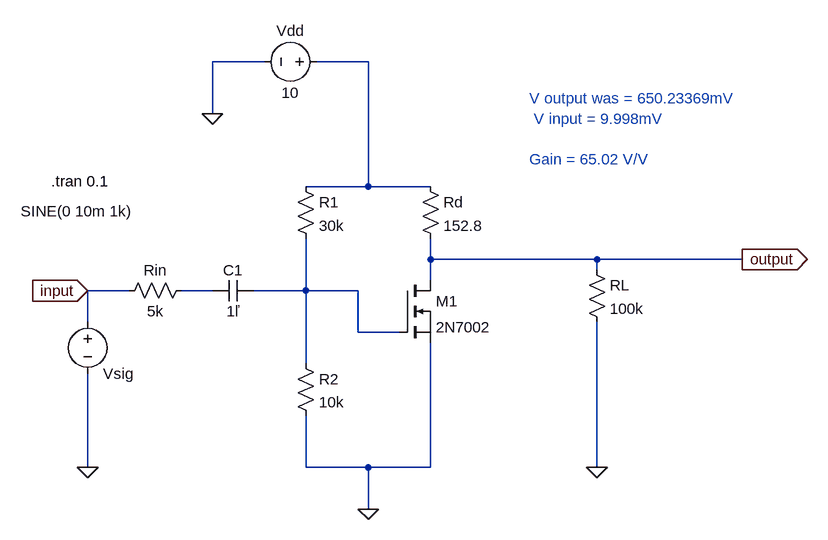
[diagram p0: schematic NNM24EE065_Manvith.asc]
NNM24EE065_Manvith.asc, the LTspice schematic file:
Version 4
SHEET 1 1220 680
WIRE 288 -208 208 -208
WIRE 448 -208 368 -208
WIRE 208 -128 208 -208
WIRE 448 -16 448 -208
WIRE 448 -16 352 -16
WIRE 544 -16 448 -16
WIRE 544 96 544 64
WIRE 800 96 544 96
WIRE 1024 96 800 96
WIRE 800 112 800 96
WIRE 544 128 544 96
WIRE 80 144 16 144
WIRE 208 144 160 144
WIRE 352 144 352 64
WIRE 352 144 272 144
WIRE 432 144 352 144
WIRE 16 192 16 144
WIRE 432 208 432 144
WIRE 496 208 432 208
WIRE 352 256 352 144
WIRE 16 416 16 272
WIRE 352 416 352 336
WIRE 448 416 352 416
WIRE 544 416 544 224
WIRE 544 416 448 416
WIRE 800 416 800 192
WIRE 448 480 448 416
FLAG 16 416 0
FLAG 800 416 0
FLAG 1024 96 output
IOPIN 1024 96 Out
FLAG 16 144 input
IOPIN 16 144 In
FLAG 208 -128 0
FLAG 448 480 0
SYMBOL voltage 16 176 R0
WINDOW 0 24 96 Left 2
WINDOW 3 -103 -154 Left 2
WINDOW 123 0 0 Left 0
WINDOW 39 0 0 Left 0
SYMATTR InstName Vsig
SYMATTR Value SINE(0 10m 1k)
SYMBOL voltage 384 -208 R90
WINDOW 0 -32 56 VBottom 2
WINDOW 3 32 56 VTop 2
SYMATTR InstName Vdd
SYMATTR Value 10
SYMBOL res 336 -32 R0
SYMATTR InstName R1
SYMATTR Value 30k
SYMBOL res 336 240 R0
SYMATTR InstName R2
SYMATTR Value 10k
SYMBOL res 528 -32 R0
SYMATTR InstName Rd
SYMATTR Value 152.8
SYMBOL res 784 96 R0
SYMATTR InstName RL
SYMATTR Value 100k
SYMBOL nmos 496 128 R0
SYMATTR InstName M1
SYMATTR Value 2N7002
SYMBOL cap 272 128 R90
WINDOW 0 0 32 VBottom 2
WINDOW 3 32 32 VTop 2
SYMATTR InstName C1
SYMATTR Value 1ľ
SYMBOL res 176 128 R90
WINDOW 0 0 56 VBottom 2
WINDOW 3 32 56 VTop 2
SYMATTR InstName Rin
SYMATTR Value 5k
TEXT -40 -24 Left 2 !.tran 0.1
TEXT 696 -152 Left 2 ;V output was = 650.23369mV \n V input = 9.998mV\n \nGain = 65.02 V/V

The netlist it stands for:
* NNM24EE065_Manvith.asc
Vsig input 0 SINE(0 10m 1k)
Vdd N001 0 10
R1 N001 N003 30k
R2 N003 0 10k
Rd N001 output 152.8
RL output 0 100k
M1 output N003 0 0 2N7002
C1 N003 N002 1ľ
Rin N002 input 5k
.model NMOS NMOS
.model PMOS PMOS
.lib standard.mos
.tran 0.1
* V output was = 650.23369mV
*  V input = 9.998mV
* Gain = 65.02 V/V
.backanno
.end